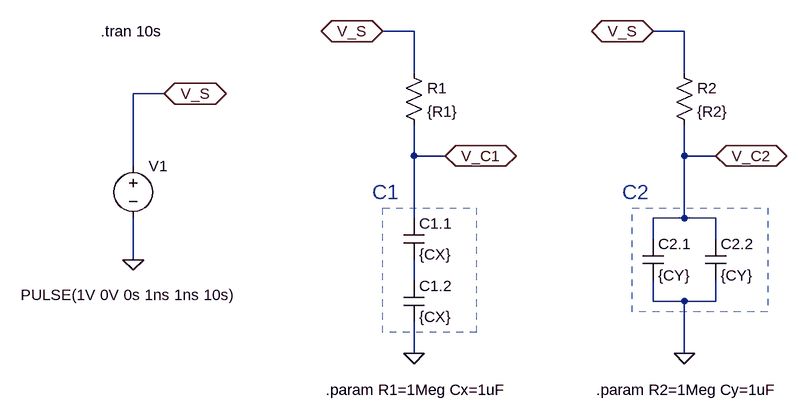
[diagram p0: schematic Ex_C_series_C_parallel_V001.asc]
Ex_C_series_C_parallel_V001.asc, the LTspice schematic file:
Version 4
SHEET 1 1136 680
WIRE 48 -176 0 -176
WIRE 464 -176 416 -176
WIRE 48 -112 48 -176
WIRE 464 -112 464 -176
WIRE -336 -80 -384 -80
WIRE 48 16 48 -32
WIRE 96 16 48 16
WIRE 464 16 464 -32
WIRE 512 16 464 16
WIRE -384 32 -384 -80
WIRE 48 112 48 16
WIRE 464 112 464 16
WIRE 464 112 416 112
WIRE 512 112 464 112
WIRE 416 144 416 112
WIRE 512 144 512 112
WIRE -384 176 -384 112
WIRE 48 208 48 176
WIRE 416 240 416 208
WIRE 464 240 416 240
WIRE 512 240 512 208
WIRE 512 240 464 240
WIRE 48 320 48 272
WIRE 464 320 464 240
FLAG 48 320 0
FLAG 464 320 0
FLAG 96 16 V_C1
IOPIN 96 16 BiDir
FLAG 512 16 V_C2
IOPIN 512 16 BiDir
FLAG 0 -176 V_S
IOPIN 0 -176 BiDir
FLAG 416 -176 V_S
IOPIN 416 -176 BiDir
FLAG -384 176 0
FLAG -336 -80 V_S
IOPIN -336 -80 BiDir
SYMBOL cap 32 112 R0
SYMATTR InstName C1.1
SYMATTR Value {CX}
SYMBOL cap 32 208 R0
SYMATTR InstName C1.2
SYMATTR Value {CX}
SYMBOL cap 400 144 R0
SYMATTR InstName C2.1
SYMATTR Value {CY}
SYMBOL cap 496 144 R0
SYMATTR InstName C2.2
SYMATTR Value {CY}
SYMBOL res 32 -128 R0
SYMATTR InstName R1
SYMATTR Value {R1}
SYMBOL res 448 -128 R0
SYMATTR InstName R2
SYMATTR Value {R2}
SYMBOL voltage -384 16 R0
WINDOW 3 -173 214 Left 2
WINDOW 123 0 0 Left 0
WINDOW 39 0 0 Left 0
SYMATTR InstName V1
SYMATTR Value PULSE(1V 0V 0s 1ns 1ns 10s)
TEXT -16 72 Left 3 ;C1
TEXT 368 72 Left 3 ;C2
TEXT -434 -176 Left 2 !.tran 10s
TEXT -88 376 Left 2 !.param R1=1Meg Cx=1uF
TEXT 328 376 Left 2 !.param R2=1Meg Cy=1uF
RECTANGLE Normal 144 288 0 96 1
RECTANGLE Normal 592 256 384 96 1

The netlist it stands for:
* Ex_C_series_C_parallel_V001.asc
C1.1 V_C1 N001 {CX}
C1.2 N001 0 {CX}
C2.1 V_C2 0 {CY}
C2.2 V_C2 0 {CY}
R1 V_S V_C1 {R1}
R2 V_S V_C2 {R2}
V1 V_S 0 PULSE(1V 0V 0s 1ns 1ns 10s)
* C1
* C2
.tran 10s
.param R1=1Meg Cx=1uF
.param R2=1Meg Cy=1uF
.backanno
.end